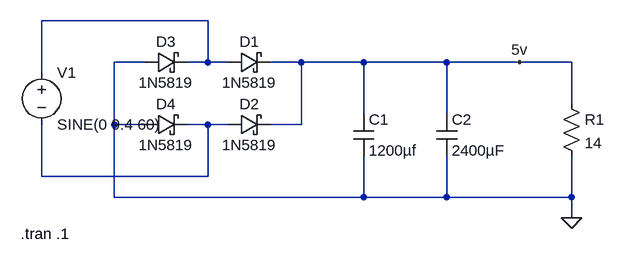
[diagram p0: schematic Sim-01.asc]
Sim-01.asc, the LTspice schematic file:
Version 4
SHEET 1 952 680
WIRE 256 0 0 0
WIRE 160 64 112 64
WIRE 256 64 256 0
WIRE 256 64 224 64
WIRE 288 64 256 64
WIRE 400 64 352 64
WIRE 496 64 400 64
WIRE 624 64 496 64
WIRE 736 64 624 64
WIRE 816 64 736 64
WIRE 0 80 0 0
WIRE 816 128 816 64
WIRE 496 144 496 64
WIRE 624 144 624 64
WIRE 112 160 112 64
WIRE 160 160 112 160
WIRE 256 160 224 160
WIRE 288 160 256 160
WIRE 400 160 400 64
WIRE 400 160 352 160
WIRE 0 240 0 160
WIRE 256 240 256 160
WIRE 256 240 0 240
WIRE 112 272 112 160
WIRE 496 272 496 208
WIRE 496 272 112 272
WIRE 624 272 624 208
WIRE 624 272 496 272
WIRE 816 272 816 208
WIRE 816 272 624 272
WIRE 816 304 816 272
FLAG 736 64 5v
FLAG 816 304 0
SYMBOL voltage 0 64 R0
WINDOW 123 0 0 Left 0
WINDOW 39 0 0 Left 0
SYMATTR InstName V1
SYMATTR Value SINE(0 9.4 60)
SYMBOL schottky 288 80 R270
WINDOW 0 32 32 VTop 2
WINDOW 3 0 32 VBottom 2
SYMATTR InstName D1
SYMATTR Value 1N5819
SYMATTR Description Diode
SYMATTR Type diode
SYMBOL schottky 288 176 R270
WINDOW 0 32 32 VTop 2
WINDOW 3 0 32 VBottom 2
SYMATTR InstName D2
SYMATTR Value 1N5819
SYMATTR Description Diode
SYMATTR Type diode
SYMBOL schottky 160 80 R270
WINDOW 0 32 32 VTop 2
WINDOW 3 0 32 VBottom 2
SYMATTR InstName D3
SYMATTR Value 1N5819
SYMATTR Description Diode
SYMATTR Type diode
SYMBOL schottky 160 176 R270
WINDOW 0 32 32 VTop 2
WINDOW 3 0 32 VBottom 2
SYMATTR InstName D4
SYMATTR Value 1N5819
SYMATTR Description Diode
SYMATTR Type diode
SYMBOL cap 480 144 R0
SYMATTR InstName C1
SYMATTR Value 1200µf
SYMBOL cap 608 144 R0
SYMATTR InstName C2
SYMATTR Value 2400µF
SYMBOL res 800 112 R0
SYMATTR InstName R1
SYMATTR Value 14
TEXT -32 328 Left 2 !.tran .1

The netlist it stands for:
* Sim-01.asc
V1 N001 N002 SINE(0 9.4 60)
D1 N001 5v 1N5819
D2 N002 5v 1N5819
D3 0 N001 1N5819
D4 0 N002 1N5819
C1 5v 0 1200µf
C2 5v 0 2400µF
R1 5v 0 14
.model D D
.lib standard.dio
.tran .1
.backanno
.end